# EAGLE design stm32_bob_v2 (EAGLE 7.3.0)
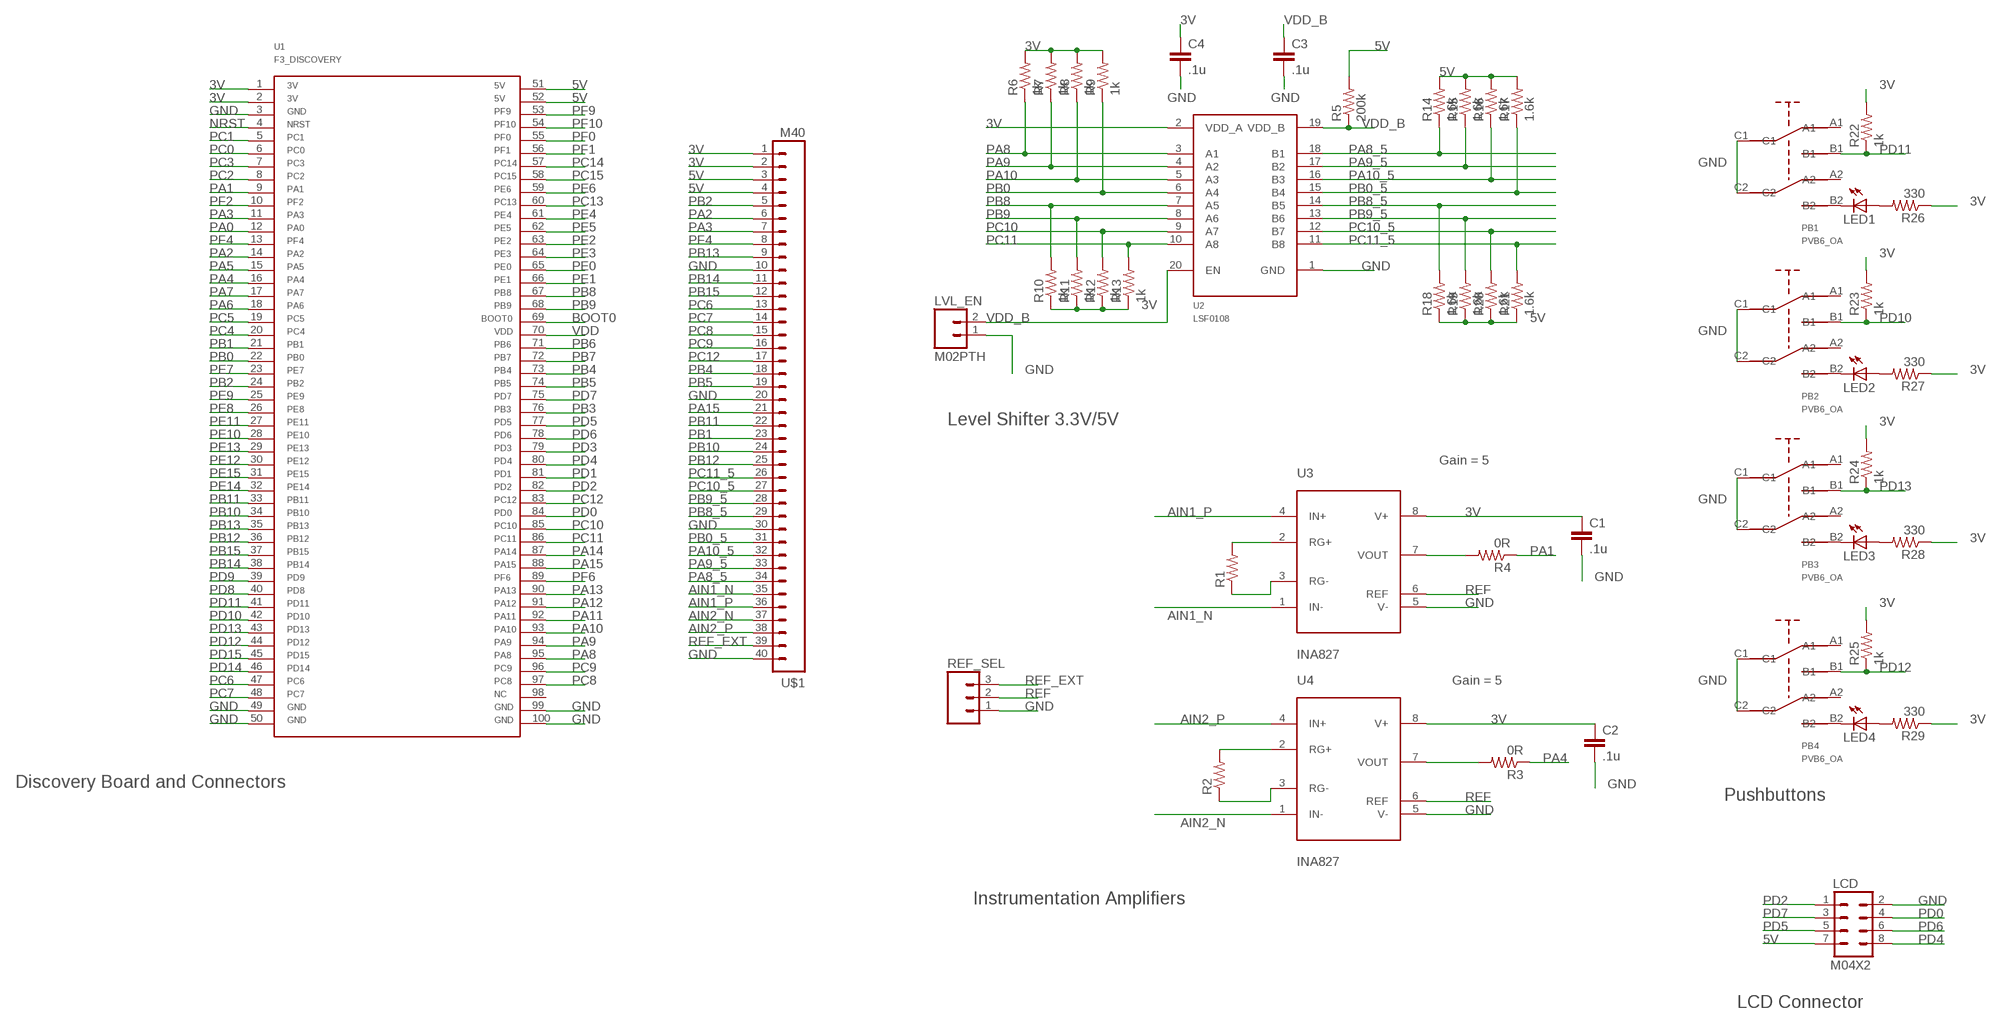
[diagram p0: schematic, sheet 1]

## Parts
C1  .1u  C-EUC0805  [C0805]
C2  .1u  C-EUC0805  [C0805]
C3  .1u  C-EUC0805  [C0805]
C4  .1u  C-EUC0805  [C0805]
LCD  M04X2  [2X4]
LED1  LED1206  [LED-1206]
LED2  LED1206  [LED-1206]
LED3  LED1206  [LED-1206]
LED4  LED1206  [LED-1206]
LVL_EN  M02PTH  [1X02]
PB1  PVB6_OA  [PVB6_OA]
PB2  PVB6_OA  [PVB6_OA]
PB3  PVB6_OA  [PVB6_OA]
PB4  PVB6_OA  [PVB6_OA]
R1  R-US_R1206  [R1206]
R2  R-US_R1206  [R1206]
R3  0R  R-US_R1206  [R1206]
R4  0R  R-US_R1206  [R1206]
R5  200k  R-US_R0805  [R0805]
R6  1k  R-US_R0805  [R0805]
R7  1k  R-US_R0805  [R0805]
R8  1k  R-US_R0805  [R0805]
R9  1k  R-US_R0805  [R0805]
R10  1k  R-US_R0805  [R0805]
R11  1k  R-US_R0805  [R0805]
R12  1k  R-US_R0805  [R0805]
R13  1k  R-US_R0805  [R0805]
R14  1.6k  R-US_R0805  [R0805]
R15  1.6k  R-US_R0805  [R0805]
R16  1.6k  R-US_R0805  [R0805]
R17  1.6k  R-US_R0805  [R0805]
R18  1.6k  R-US_R0805  [R0805]
R19  1.6k  R-US_R0805  [R0805]
R20  1.6k  R-US_R0805  [R0805]
R21  1.6k  R-US_R0805  [R0805]
R22  1k  R-US_R0805  [R0805]
R23  1k  R-US_R0805  [R0805]
R24  1k  R-US_R0805  [R0805]
R25  1k  R-US_R0805  [R0805]
R26  330  R-US_R0805  [R0805]
R27  330  R-US_R0805  [R0805]
R28  330  R-US_R0805  [R0805]
R29  330  R-US_R0805  [R0805]
REF_SEL  M03PTH  [1X03]
U1  F3_DISCOVERY  [F3_DISCOVERY]
U2  LSF0108  [LSF0108]
U3  INA827  [MSOP8]
U4  INA827  [MSOP8]
U$1  M40  [1X40]

## Nets
3V: C1.1 C2.1 C4.1 R6.2 R7.2 R8.2 R9.2 R10.1 R11.1 R12.1 R13.1 R22.2 R23.2 R24.2 R25.2 R26.1 R27.1 R28.1 R29.1 U1.1 U1.2 U2.2(VDD_A) U3.8(V+) U4.8(V+) U$1.1 U$1.2
5V: LCD.7 R5.2 R14.2 R15.2 R16.2 R17.2 R18.1 R19.1 R20.1 R21.1 U1.51 U1.52 U$1.3 U$1.4
AIN1_N: U3.1(IN-) U$1.35
AIN1_P: U3.4(IN+) U$1.36
AIN2_N: U4.1(IN-) U$1.37
AIN2_P: U4.4(IN+) U$1.38
BOOT0: U1.69
GND: C1.2 C2.2 C3.2 C4.2 LCD.2 LVL_EN.1 PB1.C1 PB1.C2 PB2.C1 PB2.C2 PB3.C1 PB3.C2 PB4.C1 PB4.C2 REF_SEL.1 U1.3 U1.49 U1.50 U1.99 U1.100 U2.1(GND) U3.5(V-) U4.5(V-) U$1.10 U$1.20 U$1.30 U$1.40
N$13: R1.2 U3.2(RG+)
N$14: R1.1 U3.3(RG-)
N$15: R2.2 U4.2(RG+)
N$16: R2.1 U4.3(RG-)
N$17: R4.2 U3.7(VOUT)
N$18: R3.2 U4.7(VOUT)
N$19: LED1.C PB1.B2
N$20: LED2.C PB2.B2
N$21: LED3.C PB3.B2
N$22: LED4.C PB4.B2
N$23: LED1.A R26.2
N$24: LED2.A R27.2
N$25: LED3.A R28.2
N$26: LED4.A R29.2
NRST: U1.4
PA0: U1.12
PA1: R4.1 U1.9
PA2: U1.14 U$1.6
PA3: U1.11 U$1.7
PA4: R3.1 U1.16
PA5: U1.15
PA6: U1.18
PA7: U1.17
PA8: R6.1 U1.95 U2.3(A1)
PA8_5: R14.1 U2.18(B1) U$1.34
PA9: R7.1 U1.94 U2.4(A2)
PA9_5: R15.1 U2.17(B2) U$1.33
PA10: R8.1 U1.93 U2.5(A3)
PA10_5: R16.1 U2.16(B3) U$1.32
PA11: U1.92
PA12: U1.91
PA13: U1.90
PA14: U1.87
PA15: U1.88 U$1.21
PB0: R9.1 U1.22 U2.6(A4)
PB0_5: R17.1 U2.15(B4) U$1.31
PB1: U1.21 U$1.23
PB2: U1.24 U$1.5
PB3: U1.76
PB4: U1.73 U$1.18
PB5: U1.74 U$1.19
PB6: U1.71
PB7: U1.72
PB8: R10.2 U1.67 U2.7(A5)
PB8_5: R18.2 U2.14(B5) U$1.29
PB9: R11.2 U1.68 U2.8(A6)
PB9_5: R19.2 U2.13(B6) U$1.28
PB10: U1.34 U$1.24
PB11: U1.33 U$1.22
PB12: U1.36 U$1.25
PB13: U1.35 U$1.9
PB14: U1.38 U$1.11
PB15: U1.37 U$1.12
PC0: U1.6
PC1: U1.5
PC2: U1.8
PC3: U1.7
PC4: U1.20
PC5: U1.19
PC6: U1.47 U$1.13
PC7: U1.48 U$1.14
PC8: U1.97 U$1.15
PC9: U1.96 U$1.16
PC10: R12.2 U1.85 U2.9(A7)
PC10_5: R20.2 U2.12(B7) U$1.27
PC11: R13.2 U1.86 U2.10(A8)
PC11_5: R21.2 U2.11(B8) U$1.26
PC12: U1.83 U$1.17
PC13: U1.60
PC14: U1.57
PC15: U1.58
PD0: LCD.4 U1.84
PD1: U1.81
PD2: LCD.1 U1.82
PD3: U1.79
PD4: LCD.8 U1.80
PD5: LCD.5 U1.77
PD6: LCD.6 U1.78
PD7: LCD.3 U1.75
PD8: U1.40
PD9: U1.39
PD10: PB2.B1 R23.1 U1.42
PD11: PB1.B1 R22.1 U1.41
PD12: PB4.B1 R25.1 U1.44
PD13: PB3.B1 R24.1 U1.43
PD14: U1.46
PD15: U1.45
PE0: U1.65
PE1: U1.66
PE2: U1.63
PE3: U1.64
PE4: U1.61
PE5: U1.62
PE6: U1.59
PE7: U1.23
PE8: U1.26
PE9: U1.25
PE10: U1.28
PE11: U1.27
PE12: U1.30
PE13: U1.29
PE14: U1.32
PE15: U1.31
PF0: U1.55
PF1: U1.56
PF2: U1.10
PF4: U1.13 U$1.8
PF6: U1.89
PF9: U1.53
PF10: U1.54
REF: REF_SEL.2 U3.6(REF) U4.6(REF)
REF_EXT: REF_SEL.3 U$1.39
VDD: U1.70
VDD_B: C3.1 LVL_EN.2 R5.1 U2.19(VDD_B) U2.20(EN)
Unconnected: PB1.A1 PB1.A2 PB2.A1 PB2.A2 PB3.A1 PB3.A2 PB4.A1 PB4.A2 U1.98

## Notes on the sheet
- Level Shifter 3.3V/5V
- Gain = 5
- Gain = 5
- Discovery Board and Connectors
- Pushbuttons
- Instrumentation Amplifiers
- LCD Connector

## Library data of the parts
C1-C4 = rcl:C-EU: CAPACITOR, European symbol
LCD = SparkFun-Connectors:M04X2: .1" header, two rows of four.
LED1-LED4 = SparkFun-LED:LED: LEDs Standard schematic elements and footprints for 5mm, 3mm, 1206, and 0603 sized LEDs. 5mm - Spark Fun Electronics SKU : COM-00529 (and others)
LVL_EN = SparkFun-Connectors:M02: Standard 2-pin 0.1" header. Use with - straight break away headers ( PRT-00116) - right angle break away headers (PRT-00553) - swiss pins (PRT-00743) - machine pins (PRT-00117) - female headers (PRT-00115) Molex polarized connector foot print use with: PRT-08233 with associated crimp pins and housings. 2.54_SCREWTERM for use with PRT-10571. 3.5mm Screw Terminal footprints for PRT-08084 5mm Screw Terminal footprints for use with PRT-08433
PB1-PB4 = green-electronics:PVB6_OA
R1-R29 = rcl:R-US_: RESISTOR, American symbol
REF_SEL = SparkFun-Connectors:M03: Header 3 Standard 3-pin 0.1" header. Use with straight break away headers (SKU : PRT-00116), right angle break away headers (PRT-00553), swiss pins (PRT-00743), machine pins (PRT-00117), and female headers (PRT-00115). Molex polarized connector foot print use with SKU : PRT-08232 with associated crimp pins and housings.
U1 = green-electronics:F3_DISCOVERY
U2 = green-electronics:LSF0108
U3 U4 = littlebox:INA827
U$1 = SparkFun-Connectors:M40: 1x40 .1" header

## Board
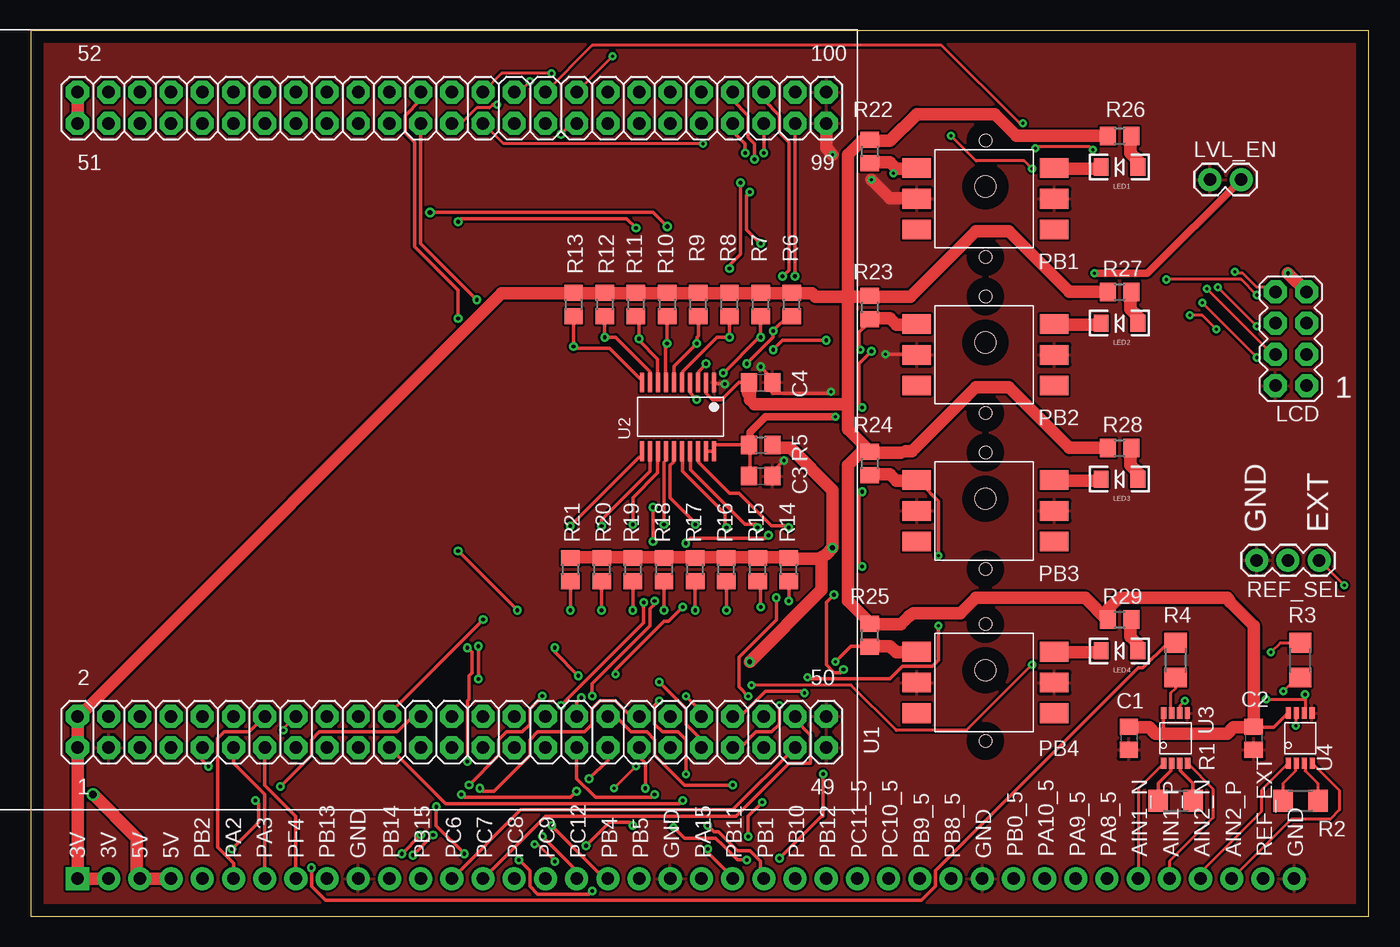
[diagram p1: board, top side]
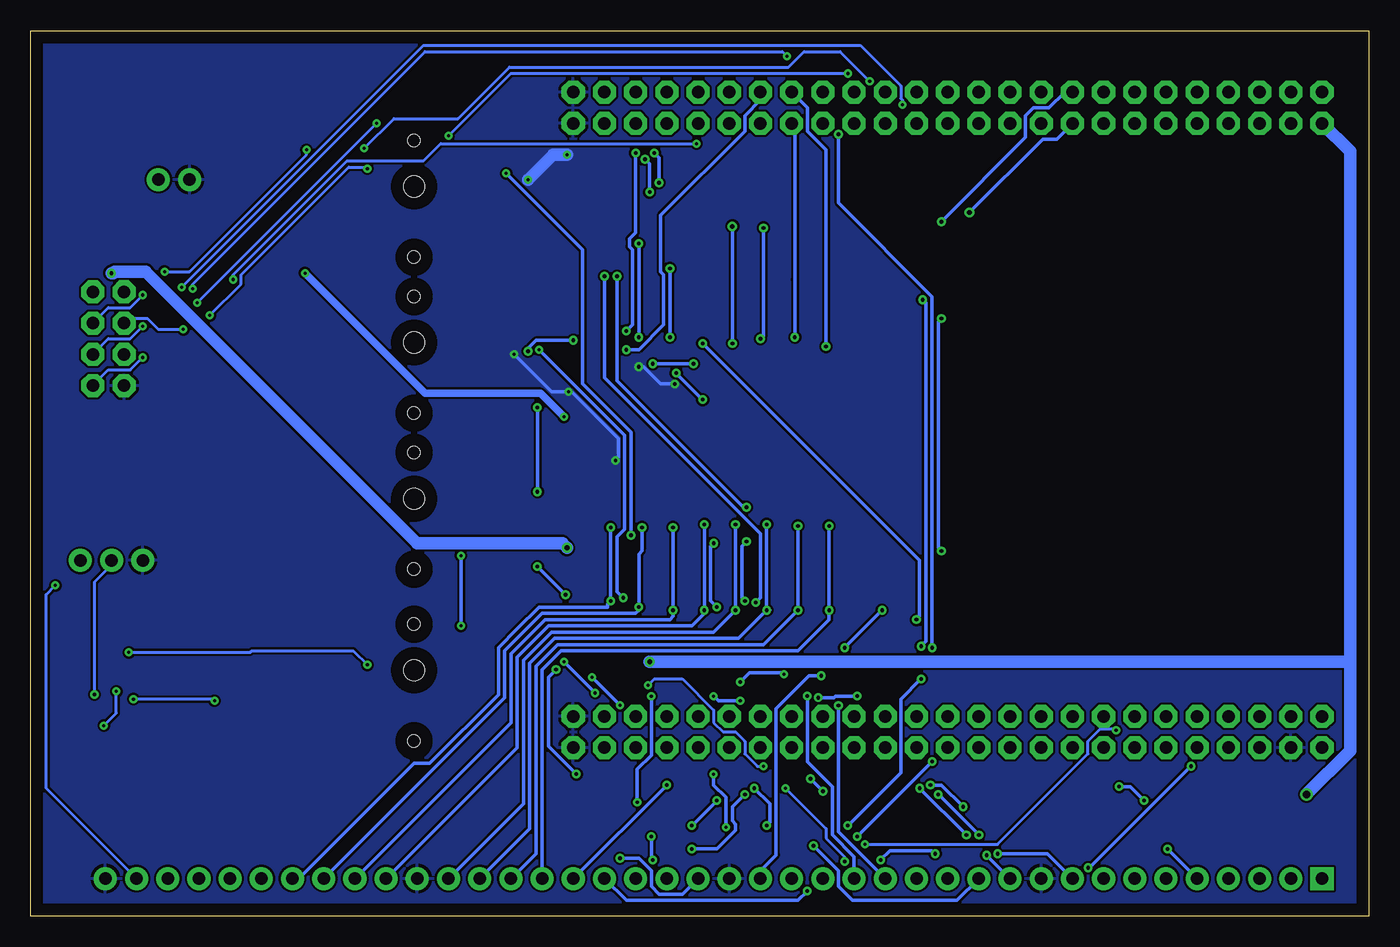
[diagram p2: board, bottom side, seen from below]

Size 108.95 x 72.06 mm. Coordinates in mm from the lower left corner, seen from the top.
Outline: 0,0 108.95,0 108.95,72.06 0,72.06 0,0
Copper layers (1*16): Top 0.035mm / dielectric 1.5mm / Bottom 0.035mm
Design rules "default *": minimum track width 10mil, minimum drill 10mil, track to track 7mil, track to pad 7mil, pad to pad 7mil, via to via 7mil, smd to smd 0mil, copper to edge 40mil, drill to drill 8mil, minimum pad ring 10mil, minimum via ring 8mil, stop-mask expansion 4mil, vias tented up to drill 25mil, thermal gap 10mil

### Footprints (pad centres in the part's own frame; a part is rotated, then mirrored left to right if it is on the bottom)
C0805 = smd 1.3 x 1.5: 1 -0.95,0; 2 0.95,0
2X4 = drill 1.016 pad 1.88 octagon: 1 -3.81,-1.27; 2 -3.81,1.27; 3 -1.27,-1.27; 4 -1.27,1.27; 5 1.27,-1.27; 6 1.27,1.27; 7 3.81,-1.27; 8 3.81,1.27
LED-1206 = smd 1.2 x 1.4: A -1.5,0; C 1.5,0
1X02 = drill 1.016 pad 1.88: 1 0,0; 2 2.54,0
PVB6_OA = smd 2.3 x 1.6: A1 0,0; A2 11.2,0; B1 0,5; B2 11.2,5; C1 0,2.5; C2 11.2,2.5 | hole 1: 5.6,7.25; 5.6,-2.25 | hole 1.7: 5.6,3.5
R1206 = smd 1.6 x 1.803: 1 -1.422,0; 2 1.422,0
R0805 = smd 1.3 x 1.5: 1 -0.95,0; 2 0.95,0
1X03 = drill 1.016 pad 1.88: 1 0,0; 2 2.54,0; 3 5.08,0
F3_DISCOVERY = drill 1.016 pad 1.88 octagon: 1 0,0; 2 0,2.54; 3 2.54,0; 4 2.54,2.54; 5 5.08,0; 6 5.08,2.54; 7 7.62,0; 8 7.62,2.54; 9 10.16,0; 10 10.16,2.54; 11 12.7,0; 12 12.7,2.54; 13 15.24,0; 14 15.24,2.54; 15 17.78,0; 16 17.78,2.54; 17 20.32,0; 18 20.32,2.54; 19 22.86,0; 20 22.86,2.54; 21 25.4,0; 22 25.4,2.54; 23 27.94,0; 24 27.94,2.54; 25 30.48,0; 26 30.48,2.54; 27 33.02,0; 28 33.02,2.54; 29 35.56,0; 30 35.56,2.54; 31 38.1,0; 32 38.1,2.54; 33 40.64,0; 34 40.64,2.54; 35 43.18,0; 36 43.18,2.54; 37 45.72,0; 38 45.72,2.54; 39 48.26,0; 40 48.26,2.54; 41 50.8,0; 42 50.8,2.54; 43 53.34,0; 44 53.34,2.54; 45 55.88,0; 46 55.88,2.54; 47 58.42,0; 48 58.42,2.54; 49 60.96,0; 50 60.96,2.54; 51 0,50.8; 52 0,53.34; 53 2.54,50.8; 54 2.54,53.34; 55 5.08,50.8; 56 5.08,53.34; 57 7.62,50.8; 58 7.62,53.34; 59 10.16,50.8; 60 10.16,53.34; 61 12.7,50.8; 62 12.7,53.34; 63 15.24,50.8; 64 15.24,53.34; 65 17.78,50.8; 66 17.78,53.34; 67 20.32,50.8; 68 20.32,53.34; 69 22.86,50.8; 70 22.86,53.34; 71 25.4,50.8; 72 25.4,53.34; 73 27.94,50.8; 74 27.94,53.34; 75 30.48,50.8; 76 30.48,53.34; 77 33.02,50.8; 78 33.02,53.34; 79 35.56,50.8; 80 35.56,53.34; 81 38.1,50.8; 82 38.1,53.34; 83 40.64,50.8; 84 40.64,53.34; 85 43.18,50.8; 86 43.18,53.34; 87 45.72,50.8; 88 45.72,53.34; 89 48.26,50.8; 90 48.26,53.34; 91 50.8,50.8; 92 50.8,53.34; 93 53.34,50.8; 94 53.34,53.34; 95 55.88,50.8; 96 55.88,53.34; 97 58.42,50.8; 98 58.42,53.34; 99 60.96,50.8; 100 60.96,53.34
LSF0108 = smd 0.3 x 1.6: 1 0,0; 2 0.65,0; 3 1.3,0; 4 1.95,0; 5 2.6,0; 6 3.25,0; 7 3.9,0; 8 4.55,0; 9 5.2,0; 10 5.85,0; 11 5.85,5.6; 12 5.2,5.6; 13 4.55,5.6; 14 3.9,5.6; 15 3.25,5.6; 16 2.6,5.6; 17 1.95,5.6; 18 1.3,5.6; 19 0.65,5.6; 20 0,5.6
MSOP8 = smd 0.9 x 0.42: 1 -2.05,0.975; 2 -2.05,0.325; 3 -2.05,-0.325; 4 -2.05,-0.975; 5 2.05,-0.945; 6 2.05,-0.325; 7 2.05,0.325; 8 2.05,0.975
1X40 = drill 1.016 pad 1.88 square: 1 -49.53,0 | drill 1.016 pad 1.88: 2 -46.99,0; 3 -44.45,0; 4 -41.91,0; 5 -39.37,0; 6 -36.83,0; 7 -34.29,0; 8 -31.75,0; 9 -29.21,0; 10 -26.67,0; 11 -24.13,0; 12 -21.59,0; 13 -19.05,0; 14 -16.51,0; 15 -13.97,0; 16 -11.43,0; 17 -8.89,0; 18 -6.35,0; 19 -3.81,0; 20 -1.27,0; 21 1.27,0; 22 3.81,0; 23 6.35,0; 24 8.89,0; 25 11.43,0; 26 13.97,0; 27 16.51,0; 28 19.05,0; 29 21.59,0; 30 24.13,0; 31 26.67,0; 32 29.21,0; 33 31.75,0; 34 34.29,0; 35 36.83,0; 36 39.37,0; 37 41.91,0; 38 44.45,0; 39 46.99,0; 40 49.53,0

### Placement (x,y rotation side)
C1  89.41,14.48 270 top
C2  99.57,14.48 270 top
C3  59.44,35.81 0 top
C4  59.44,43.43 0 top
LCD  102.62,46.99 90 top
LED1  88.65,60.96 180 top
LED2  88.65,48.26 180 top
LED3  88.65,35.56 180 top
LED4  88.65,21.59 180 top
LVL_EN  96.01,59.94 0 top
PB1  72.14,55.88 0 top
PB2  72.14,43.18 0 top
PB3  72.14,30.48 0 top
PB4  72.14,16.51 0 top
R1  93.22,9.4 180 top
R2  103.38,9.4 180 top
R3  103.38,20.83 270 top
R4  93.22,20.83 270 top
R5  59.44,38.35 0 top
R6  61.98,49.78 90 top
R7  59.44,49.78 90 top
R8  56.9,49.78 90 top
R9  54.36,49.78 90 top
R10  51.82,49.78 270 top
R11  49.28,49.78 270 top
R12  46.74,49.78 270 top
R13  44.2,49.78 270 top
R14  61.72,28.19 90 top
R15  59.18,28.19 90 top
R16  56.64,28.19 90 top
R17  54.1,28.19 90 top
R18  51.56,28.19 270 top
R19  49.02,28.19 270 top
R20  46.48,28.19 270 top
R21  43.94,28.19 270 top
R22  68.33,62.23 90 top
R23  68.33,49.53 90 top
R24  68.33,36.83 90 top
R25  68.33,22.86 90 top
R26  88.65,63.5 0 top
R27  88.65,50.8 0 top
R28  88.65,38.1 0 top
R29  88.65,24.13 0 top
REF_SEL  99.82,28.96 0 top
U1  3.81,13.72 0 top
U2  55.63,43.43 180 top
U3  93.22,14.48 90 top
U4  103.38,14.48 90 top
U$1  53.34,3.05 0 top

### Tracks (layer width: path | path; a pad name or v marks a point on that pad's centre or on a via)
3V
  Top 0.305: C4.1 58.42,43.43 57.66,43.43 56.26,42.04 55.5,42.04 54.99,42.55 U2.2 | U3.8 92.2,16.51 92.2,15.24 92.2,14.86 | U4.8 102.36,16.51 101.22,15.37 100.08,15.37 C2.1
  Top 1.016: U$1.2 4.06,3.05 U$1.1 3.81,4.83 3.81,5.08 3.81,13.46 U1.1 U1.2 4.19,16.51 38.35,50.67 43.81,50.67 R13.1 44.2,50.67 46.74,50.67 R12.1 47.12,50.67 49.28,50.67 R11.1 49.66,50.67 51.82,50.67 R10.1 52.2,50.67 54.36,50.67 R9.2 54.74,50.67 56.9,50.67 R8.2 57.28,50.67 59.44,50.67 R7.2 59.82,50.67 61.98,50.67 R6.2 62.36,50.67 63.63,50.67 63.88,50.42 66.55,50.42 | 66.55,50.42 68.33,50.42 R23.2 68.71,50.42 68.83,50.42 69.22,50.42 71.63,50.42 76.96,55.75 79.63,55.75 84.58,50.8 87.63,50.8 R27.1 | 66.55,50.42 66.55,50.8 66.55,61.98 67.69,63.12 68.33,63.12 R22.2 68.71,63.12 69.98,63.12 72.14,65.28 78.49,65.28 80.26,63.5 87.63,63.5 R26.1 | 66.55,41.66 66.55,39.62 68.33,37.85 R24.2 | 66.55,41.66 66.55,50.04 66.55,50.42 | 58.55,42.55 58.42,42.55 | 58.55,42.55 58.55,42.04 58.93,41.66 66.17,41.66 66.55,41.66 | C4.1 58.55,43.31 58.55,42.93 58.55,42.55 | R24.2 67.69,37.85 66.55,36.7 66.55,25.65 68.33,23.88 R25.2 68.71,23.75 70.87,23.75 71.5,24.38 71.88,24.64 75.69,24.64 76.96,25.91 85.85,25.91 87.63,24.13 R29.1 87.76,24.64 87.76,25.02 88.65,25.91 97.41,25.91 97.66,25.53 99.57,23.62 99.57,15.49 C2.1 99.19,15.37 97.92,15.37 97.41,14.86 92.2,14.86 91.57,14.86 91.06,15.37 89.41,15.37 C1.1 | R28.1 87.63,38.1 84.58,38.1 79.63,43.05 76.96,43.05 71.75,37.85 71.25,37.85 70.87,37.72 68.96,37.72 68.83,37.85 R24.2
5V  (via drill 0.3, 0.38, 0.6)
  Top 1.016: U$1.4 U$1.3 8.64,3.3 8.64,6.35 v5.08,9.91 | U1.52 U1.51 | R21.1 43.94,29.21 46.48,29.21 R20.1 46.74,29.21 49.02,29.21 R19.1 49.28,29.21 51.56,29.21 R18.1 51.82,29.21 54.1,29.21 R17.2 54.36,29.21 56.64,29.21 R16.2 56.9,29.21 59.18,29.21 R15.2 59.44,29.21 61.72,29.21 R14.2 62.1,29.08 64.01,29.08 64.39,29.08 | 64.39,29.08 64.39,26.54 v58.55,20.7 | 64.39,29.08 64.39,29.21 64.77,29.46 v65.28,29.97 65.28,30.35 65.28,34.67 61.85,38.1 60.45,38.1 60.33,38.23 60.33,38.35 R5.2 | v102.36,52.32 LCD.7
  Bottom 1.016: v5.08,9.91 1.52,13.46 1.52,20.7 | 1.52,20.7 1.52,62.23 U1.51 | v58.55,20.7 1.91,20.7 1.52,20.7 | v102.36,52.32 102.23,52.32 102.11,52.45 99.57,52.45 77.47,30.35 65.66,30.35 v65.28,29.97
AIN1_N
  Top 0.254: U3.1 90.17,10.36 90.17,7.75 U$1.35
AIN1_P
  Top 0.254: U3.4 96.27,10.36 96.27,8 92.71,4.45 U$1.36
AIN2_N
  Top 0.254: U4.1 100.2,10.23 100.2,8.51 95.25,3.56 U$1.37
AIN2_P
  Top 0.254: U4.4 106.55,10.23 106.55,8.64 105.79,7.87 102.62,7.87 U$1.38
GND  (via drill 0.25, 0.3)
  Top 0.305: v69.6,45.72 72.14,45.72 PB2.C1 | v65.15,42.67 65.02,42.55 60.45,42.55 60.33,42.67 60.33,43.43 C4.2 60.33,43.56 60.33,43.81 v59.44,44.7 | v61.34,37.08 60.33,36.07 60.33,35.81 C3.2 | v56.52,43.31 55.63,43.31 U2.1
  Top 1.016: U1.99 64.77,62.48 v65.28,61.98 | v68.45,59.94 69.98,58.42 72.14,58.42 PB1.C1
  Bottom 0.305: v69.6,45.72 66.55,42.67 v65.15,42.67 65.02,42.67 64.9,42.67 61.09,38.86 61.09,37.34 v61.34,37.08 | v59.44,44.7 59.05,44.7 57.66,43.31 v56.52,43.31
  Bottom 1.016: v65.28,61.98 66.42,61.98 v68.45,59.94
  pour Top: 109.22,71.88 109.22,-0.25 0,-0.25 0.25,71.88
  pour Bottom: 0.25,72.39 109.47,72.39 109.47,0.25 0.25,0.25
N$13
  Top 0.305: U3.2 92.84,12.32 92.84,11.81 91.82,10.79 91.82,9.4 R1.2
N$14
  Top 0.305: U3.3 93.6,12.32 93.6,11.81 94.61,10.79 94.61,9.4 R1.1
N$15
  Top 0.254: U4.2 103,12.32 103,11.81 101.98,10.79 101.98,9.4 R2.2
N$16
  Top 0.254: R2.1 104.78,9.4 104.78,10.79 103.76,11.81 103.76,12.32 U4.3
N$17
  Top 0.254: R4.2 93.22,19.3 93.22,18.54 92.84,18.16 92.84,16.64 U3.7
N$18  (via drill 0.25)
  Top 0.254: v101.98,18.29 103.12,19.43 103.38,19.43 R3.2 | v103,15.49 103,16.51 U4.7
  Bottom 0.254: v101.98,18.29 101.98,16.51 v103,15.49
N$19
  Top 1.016: PB1.B2 83.44,60.83 87.12,60.83 87.25,60.96 LED1.C
N$20
  Top 1.016: PB2.B2 83.44,48.13 87.12,48.13 87.25,48.26 LED2.C
N$21
  Top 1.016: PB3.B2 83.44,35.43 87.12,35.43 87.25,35.56 LED3.C
N$22
  Top 1.016: PB4.B2 83.44,21.46 87.12,21.46 87.25,21.59 LED4.C
N$23
  Top 1.016: LED1.A 90.17,60.96 90.17,61.47 89.53,62.1 89.53,63.5 R26.2
N$24
  Top 1.016: LED2.A 90.17,48.26 90.17,48.77 89.53,49.4 89.53,50.8 R27.2
N$25
  Top 1.016: LED3.A 90.17,35.56 90.17,36.07 89.53,36.7 89.53,38.1 R28.2
N$26
  Top 1.016: LED4.A 90.17,21.59 90.17,22.1 89.53,22.73 89.53,24.13 R29.2
PA1  (via drill 0.3)
  Top 0.305: U1.9 13.97,12.7 v14.48,12.19 | v22.86,3.94 22.86,2.41 24,1.27 72.52,1.27 73.66,2.41 73.66,3.68 90.17,20.19 90.55,20.19 92.58,22.23 93.22,22.23 R4.1
  Bottom 0.305: v14.48,12.19 22.73,3.94 v22.86,3.94
PA2
  Top 0.305: U$1.6 16.51,4.32 15.24,5.59 15.24,14.48 15.75,14.99 17.78,14.99 U1.14
PA3
  Top 0.305: U$1.7 19.05,9.91 16.51,12.45 U1.11
PA4  (via drill 0.25)
  Top 0.254: v81.53,20.45 76.2,15.11 70.48,15.11 66.8,18.8 60.2,18.8 v58.67,18.8 | v100.97,21.46 101.73,22.23 103.38,22.23 R3.1 | U1.16 20.57,15.24 v20.57,15.11 | v41.02,5.84 41.27,5.84 v42.67,4.45 | v49.28,12.19 v47.5,10.41
  Bottom 0.254: v81.53,20.45 82.68,21.59 90.93,21.59 91.06,21.46 v100.97,21.46 | v20.57,15.11 20.7,15.24 21.84,15.24 22.86,14.22 22.86,13.21 30.23,5.84 v41.02,5.84 | v42.67,4.45 42.67,4.83 44.2,6.35 44.2,7.11 v47.5,10.41 | v49.28,12.19 49.78,12.19 50.8,13.21 50.8,14.22 51.56,14.99 52.58,14.99 53.34,15.75 53.34,16.76 55.88,19.3 58.17,19.3 v58.67,18.8
PA8  (via drill 0.3)
  Top 0.305: U1.95 v59.69,62.1 | R6.1 61.98,48.9 61.72,48.9 v60.45,47.62 60.45,47.5 60.45,47.12 v58.29,44.96 | v54.99,44.96 54.36,44.32 54.36,43.43 U2.3
  Bottom 0.305: v60.45,47.62 59.94,48.13 59.94,54.23 60.2,54.48 60.2,55.12 59.69,55.63 v59.69,62.1 | v54.99,44.96 v58.29,44.96
PA8_5  (via drill 0.3)
  Top 0.305: 61.72,27.43 61.98,27.18 61.72,26.92 v61.72,25.65 R14.1 | v61.72,31.62 61.72,31.75 60.33,31.75 57.66,34.42 56.9,34.42 54.36,36.96 54.36,37.72 54.33,37.72 U2.18
  Bottom 0.305: U$1.34 87.12,3.05 77.72,12.45 76.45,12.45 70.87,18.03 70.87,21.84 69.34,23.37 67.56,25.15 61.98,25.15 61.98,25.4 v61.72,25.65 61.72,25.78 v61.72,31.62
PA9  (via drill 0.3)
  Top 0.305: v59.44,54.74 58.29,55.88 58.29,58.67 v58.55,58.93 | v58.93,61.59 58.93,62.87 58.42,63.37 58.42,65.15 57.15,66.42 U1.94 | R7.1 v59.44,47.12 59.31,47.12 v56.39,44.2 | v54.23,42.04 53.72,42.55 53.72,43.43 U2.4
  Bottom 0.305: v58.55,58.93 58.55,61.21 v58.93,61.59 | v59.44,54.74 v59.44,47.12 | v54.23,42.04 v56.39,44.2
PA9_5  (via drill 0.3)
  Top 0.305: v59.44,25.15 59.44,27.18 59.24,27.37 | 59.18,27.43 59.24,27.37 | v59.18,31.62 59.05,31.75 59.05,31.88 58.17,31.88 53.72,36.32 53.72,37.72 53.72,37.83 U2.17 | R15.1 59.24,27.24 59.24,27.37
  Bottom 0.305: v59.44,25.15 59.44,24.89 | 59.44,24.89 59.69,24.64 67.31,24.64 69.34,22.61 70.36,21.59 70.36,17.78 U$1.33 | 59.44,24.89 v59.44,25.15 | v59.18,31.62 59.18,29.84 59.18,29.72 59.44,29.46 59.44,25.27 v59.44,25.15
PA10  (via drill 0.3)
  Top 0.305: v57.78,59.69 57.78,53.98 57.78,53.85 56.9,52.96 v56.9,52.7 | v58.17,62.1 58.17,62.87 57.15,63.88 U1.93 | R8.1 v56.9,47.12 56.77,47.12 55.88,47.12 53.09,44.32 53.09,43.43 U2.5
  Bottom 0.305: v57.78,59.69 57.78,61.72 v58.17,62.1 | v56.9,52.7 v56.9,47.12
PA10_5  (via drill 0.3)
  Top 0.305: v56.64,24.89 56.64,27.18 R16.1 | v56.64,31.62 56.52,31.75 56.52,31.88 56.52,32.77 53.09,36.2 53.09,37.72 53.03,37.72 U2.16
  Bottom 0.305: U$1.32 69.85,15.75 69.85,21.34 69.09,22.1 67.06,24.13 56.9,24.13 56.64,24.38 v56.64,24.89 56.64,25.02 v56.64,31.62
PA15  (via drill 0.3)
  Top 0.305: v64.52,11.56 64.52,8.13 64.39,8.13 v60.96,4.7 | v66.17,20.07 65.91,19.81 65.41,19.81 64.77,20.45 64.77,25.53 v65.41,26.16 | v67.69,28.45 67.44,28.7 67.44,34.29 v67.69,34.54 | v67.69,41.4 67.44,41.66 67.44,44.96 v68.45,45.97 | v64.77,46.86 61.21,46.86 v60.45,46.1
  Bottom 0.305: v64.52,11.56 66.8,13.84 66.8,19.43 v66.17,20.07 | v67.69,28.45 v65.41,26.16 | v67.69,41.4 v67.69,34.54 | v68.45,45.97 68.45,46.23 67.82,46.86 v64.77,46.86 | v60.45,46.1 59.44,46.1 57.4,48.13 57.4,52.2 57.66,52.45 57.66,57.02 50.8,63.88 50.8,65.15 49.53,66.42 U1.88 | v60.96,4.7 59.44,4.7 58.42,3.68 58.42,2.41 57.78,1.78 55.88,1.78 U$1.21
PB0  (via drill 0.3)
  Top 0.305: v36.83,24.13 29.21,16.51 U1.22 | R9.1 54.36,48.77 54.36,47.24 54.23,47.12 54.23,46.99 v54.23,46.61 52.45,44.83 52.38,44.76 U2.6
  Bottom 0.305: v54.23,46.61 36.58,28.96 36.58,24.38 v36.83,24.13
PB0_5  (via drill 0.3)
  Top 0.305: v54.1,24.89 54.1,27.18 R17.1 | v54.1,31.88 54.1,32 52.07,34.04 52.07,36.7 52.32,36.96 52.32,37.72 52.38,37.72 U2.15
  Bottom 0.305: v54.1,24.89 54.1,24.64 | 54.1,24.64 55.12,23.62 66.8,23.62 67.82,22.61 69.34,21.08 69.34,13.72 U$1.31 | 54.1,24.64 v54.1,24.89 | v54.1,31.88 54.1,25.02 v54.1,24.89
PB1  (via drill 0.3)
  Top 0.305: U1.21 33.78,9.14 52.83,9.14 v53.09,9.4 | 59.44,3.05 U$1.23 59.44,3.17 59.44,4.45 58.55,5.33 57.53,5.33 56.01,6.86 55.63,6.86 v55.12,7.37
  Bottom 0.305: v55.12,7.37 v53.09,9.4
PB2  (via drill 0.3)
  Top 0.305: U1.24 31.11,16.26 29.84,14.99 23.5,14.99 22.86,14.35 22.86,13.08 v20.32,10.54 | v18.29,9.4 18.54,9.14 18.54,7.62 v16.38,5.46
  Bottom 0.305: v20.32,10.54 19.43,10.54 v18.29,9.4 | U$1.5 v16.38,5.46
PB4  (via drill 0.3)
  Top 0.305: U1.73 31.75,54.74 v36.32,50.16 | v36.45,19.3 v36.45,21.97 | v42.42,7.37 46.74,3.05 U$1.18
  Bottom 0.305: v36.32,50.16 36.07,49.91 36.07,22.35 v36.45,21.97 | v36.45,19.3 38.1,17.65 38.1,11.68 v42.42,7.37
PB5  (via drill 0.3)
  Top 0.305: U1.74 31.75,66.42 30.48,65.15 30.48,63.75 31.24,62.99 31.24,54.48 34.8,50.93 v34.8,48.64 | v39.62,24.89 v34.8,29.72 | v42.67,21.84 42.67,21.46 v44.58,19.56
  Bottom 0.305: v34.8,48.64 35.05,48.39 35.05,29.97 v34.8,29.72 | v42.67,21.84 v39.62,24.89 | v44.58,19.56 45.59,19.56 48.26,16.89 48.26,4.95 49.53,3.68 U$1.19
PB8  (via drill 0.3, 0.38)
  Top 0.305: v32.51,57.28 41.91,57.28 50.67,57.28 v51.82,56.13 | R10.2 v51.82,46.61 51.82,46.48 51.69,46.35 51.69,43.43 U2.7
  Bottom 0.305: v32.51,57.28 26.54,63.25 25.4,63.25 U1.67 | v51.82,56.13 v51.82,46.61
PB8_5  (via drill 0.3)
  Top 0.305: v51.56,24.89 51.56,27.18 R18.2 | v51.56,31.88 51.56,31.75 51.56,36.96 51.69,37.08 51.69,37.72 51.73,37.72 U2.14
  Bottom 0.305: v51.56,24.89 51.82,24.64 | 51.82,24.64 53.34,23.11 66.55,23.11 67.82,21.84 68.83,20.83 68.83,9.14 U$1.29 | 51.82,24.64 v51.56,24.89 | v51.56,31.88 51.56,25.02 v51.56,24.89
PB9  (via drill 0.3)
  Top 0.305: v49.28,56.01 48.51,56.77 35.05,56.77 v34.8,56.52 | R11.2 49.53,48.58 v49.53,46.99 49.53,46.86 51.05,45.34 51.05,43.43 U2.8
  Bottom 0.305: v34.8,56.52 27.94,63.37 27.94,65.15 27.3,65.79 26.04,65.79 24.77,67.06 U1.68 | v49.28,56.01 49.28,47.24 v49.53,46.99
PB9_5  (via drill 0.3)
  Top 0.305: v49.02,24.89 49.02,27.18 R19.2 | v49.02,31.88 49.02,32 49.02,32.13 49.02,32.26 49.02,34.04 51.05,36.07 51.05,37.72 51.08,37.72 U2.13
  Bottom 0.305: v49.02,24.89 48.77,24.89 | v49.02,24.89 51.31,22.61 66.29,22.61 67.31,21.59 68.33,20.57 68.33,7.11 U$1.28 | v49.02,31.88 49.02,25.02 v49.02,24.89
PB10  (via drill 0.3)
  Top 0.305: U1.34 44.45,17.4 v44.83,17.78 | v41.66,17.91 40.64,16.89 40.64,15.62 40.01,14.99 38.73,14.99 38.1,14.35 38.1,13.08 v35.69,10.67 | v33.02,8.89 33.02,7.37 v35.31,5.08 | v39.75,4.57 40.64,3.68 40.64,2.41 41.27,1.78 45.47,1.78 v45.72,2.03
  Bottom 0.305: v44.83,17.78 43.56,17.78 43.43,17.91 v41.66,17.91 | v35.69,10.67 34.8,10.67 v33.02,8.89 | v35.31,5.08 35.56,5.33 38.99,5.33 v39.75,4.57 | v45.72,2.03 46.48,1.27 60.45,1.27 U$1.24
PB11  (via drill 0.3)
  Top 0.305: U1.33 44.45,11.18 45.97,9.65 50.55,9.65 v50.8,9.91 | v55.12,5.46 55.12,5.21 57.15,3.17 U$1.22
  Bottom 0.305: v50.8,9.91 51.82,8.89 51.82,7.75 51.56,7.49 51.56,6.99 53.09,5.46 v55.12,5.46
PB12  (via drill 0.3)
  Top 0.305: U1.36 47.62,16.26 48.9,14.99 50.16,14.99 50.8,14.35 50.8,13.08 53.21,10.67 v57.15,10.67
  Bottom 0.305: U$1.25 v57.15,10.67
PB13  (via drill 0.3)
  Top 0.305: U1.35 46.99,12.7 v45.47,11.18 | v44.45,10.16 43.94,9.65 35.31,9.65 v35.05,9.91 | v30.23,5.08 v31.75,6.6
  Bottom 0.305: v44.45,10.16 v45.47,11.18 | v31.75,6.6 v35.05,9.91 | v30.23,5.08 26.16,5.08 U$1.9
PB14  (via drill 0.3)
  Top 0.305: U1.38 48.9,16.26 47.62,17.53 46.35,17.53 45.72,16.89 45.72,15.62 45.09,14.99 41.27,14.99 40.64,14.35 40.64,13.08 37.72,10.16 36.83,10.16 v36.58,10.41 | v31.11,4.95 v32.77,6.6
  Bottom 0.305: v32.77,6.6 v36.58,10.41 | U$1.11 v31.11,4.95
PB15  (via drill 0.3)
  Top 0.305: U1.37 49.53,12.95 50.04,12.45 v50.04,10.41 | v49.02,7.37 48.77,7.62 47.12,7.62 v45.21,5.71
  Bottom 0.305: v50.04,10.41 48.77,9.14 48.77,7.62 v49.02,7.37 | v45.21,5.71 43.18,3.68 43.18,2.41 42.04,1.27 33.53,1.27 U$1.12
PC6
  Top 0.305: U1.47 57.15,8.64 46.99,8.64 39.88,8.64 U$1.13
PC7
  Top 0.305: U1.48 62.23,16 63.5,14.73 63.5,12.45 61.72,12.45 57.4,8.13 41.91,8.13 U$1.14
PC8  (via drill 0.3)
  Top 0.305: v62.23,52.07 U1.97 | v49.91,25.53 49.91,23.88 v43.18,17.14
  Bottom 0.305: v62.23,52.07 62.23,43.81 49.53,31.11 49.53,25.91 v49.91,25.53 | v43.18,17.14 43.18,6.86 U$1.15
PC9  (via drill 0.3)
  Top 0.305: U1.96 59.69,66.42 60.96,65.15 60.96,63.75 61.72,62.99 61.72,52.58 v61.21,52.07 | v50.67,30.48 v50.67,33.27 | v50.8,25.65 50.8,25.4 50.42,25.02 50.42,23.62 45.72,18.92 v45.72,17.91
  Bottom 0.305: v61.21,52.07 61.21,43.56 50.93,33.27 v50.67,33.27 | v50.67,30.48 51.05,30.1 51.05,25.91 v50.8,25.65 | v45.72,17.91 45.72,12.57 43.69,10.54 43.69,6.6 41.91,4.83 U$1.16
PC10  (via drill 0.3)
  Top 0.305: 46.74,47.5 46.74,48.77 R12.2 | 46.74,47.5 v46.74,47.12 | U2.9 50.42,43.43 50.42,44.32 47.62,47.12 46.86,47.12 v46.74,47.12 | v46.74,47.12 46.74,47.5
  Bottom 0.305: U1.85 46.74,64.26 46.74,51.82 v46.74,47.12
PC10_5  (via drill 0.3)
  Top 0.305: R20.2 46.48,27.18 46.48,25.15 v46.48,24.89 | U2.12 50.42,37.72 50.42,36.2 46.48,32.26 46.48,31.88 v46.48,31.75
  Bottom 0.305: U$1.27 67.82,5.08 67.82,20.32 67.06,21.08 66.04,22.1 49.28,22.1 v46.48,24.89 46.48,25.02 v46.48,31.75
PC11  (via drill 0.3)
  Top 0.305: U2.10 49.78,43.56 47.12,46.23 44.2,46.23 v44.2,46.35 R13.2
  Bottom 0.305: 44.2,46.23 v44.2,46.35 44.2,62.36 45.72,63.88 45.72,65.79 U1.86
PC11_5  (via drill 0.3)
  Top 0.305: v43.94,24.89 43.94,26.92 43.69,27.18 43.94,27.43 R21.2 | v43.94,31.75 49.53,37.34 49.78,37.34 49.78,37.59 U2.11
  Bottom 0.305: U$1.26 67.31,20.07 65.79,21.59 55.12,21.59 46.48,21.59 43.94,24.13 v43.94,24.89 v43.94,31.75
PC12  (via drill 0.3)
  Top 0.305: U1.83 44.07,64.52 v43.18,63.63 | v35.56,21.84 35.94,21.46 35.94,19.81 35.69,19.56 35.69,17.65 35.56,17.53 v35.56,12.57 | v41.66,6.48 44.45,3.68 U$1.17
  Bottom 0.305: v43.18,63.63 43.18,58.04 35.56,50.42 v35.56,21.84 | v41.66,6.48 v35.56,12.57
PD0  (via drill 0.25)
  Top 0.254: v47.37,69.98 U1.84 | v95.76,51.05 101.09,45.72 LCD.4
  Bottom 0.254: v47.37,69.98 47.75,70.36 76.83,70.36 95.76,51.44 v95.76,51.05
PD2  (via drill 0.25)
  Top 0.254: U1.82 45.72,70.87 74.17,70.87 80.52,64.52 v80.77,64.52 | v99.82,45.47 v95.38,49.91
  Bottom 0.254: v95.38,49.91 v80.77,64.52 | v99.82,45.47 100.84,44.45 102.62,44.45 LCD.1
PD4  (via drill 0.25)
  Top 0.254: U1.80 39.75,67.06 v40.64,67.94 | v81.79,62.48 81.92,62.61 86.23,62.61 v86.49,62.36 | v98.04,52.45 98.17,52.32 98.68,52.32 99.82,51.18 100.97,51.18 LCD.8
  Bottom 0.254: v40.64,67.94 43.05,70.36 45.97,70.36 47.24,69.09 69.98,69.09 74.17,64.9 79.38,64.9 v81.79,62.48 | v86.49,62.36 86.49,61.98 96.01,52.45 v98.04,52.45
PD5  (via drill 0.25)
  Top 0.254: U1.77 38.48,62.87 v54.74,62.87 | v92.46,51.82 98.55,51.82 v99.82,50.55
  Bottom 0.254: v54.74,62.87 75.56,62.87 76.96,61.47 83.19,61.47 92.46,52.2 v92.46,51.82 | v99.82,50.55 100.84,49.53 102.62,49.53 LCD.5
PD6  (via drill 0.25)
  Top 0.254: U1.78 38.35,68.58 v42.42,68.58 | v74.93,63.5 76.96,61.47 80.9,61.47 v81.53,60.83 | v94.36,48.9 95.38,48.9 v96.52,47.75
  Bottom 0.254: v42.42,68.58 69.85,68.58 v74.93,63.5 | v81.53,60.83 81.66,60.96 83.06,60.96 91.82,52.2 91.82,51.44 v94.36,48.9 | v96.52,47.75 98.55,47.75 99.44,48.64 100.97,48.64 LCD.6
PD7  (via drill 0.25)
  Top 0.254: U1.75 35.05,64.52 36.32,65.79 37.34,65.79 37.59,66.04 v37.97,66.04 | v99.82,48.01 v96.65,51.18
  Bottom 0.254: v37.97,66.04 37.97,66.42 38.1,66.55 38.1,67.56 41.4,70.87 76.96,70.87 v96.65,51.18 | v99.82,48.01 100.84,46.99 102.62,46.99 LCD.3
PD10  (via drill 0.25, 0.3)
  Top 0.305: U1.42 54.61,16.64 v53.34,17.91 | v51.18,17.53 50.8,17.14 50.8,15.62 51.44,14.99 52.7,14.99 53.34,14.35 v53.34,11.56 | v58.42,6.48 58.42,8.13 v59.56,9.27 | v58.42,17.91 57.66,18.67 57.66,21.08 60.71,24.13 v60.71,25.91 | v67.56,46.1 67.44,46.23 67.44,47.5 68.07,48.13 R23.1 | v58.29,4.57 57.53,4.57 56.39,5.71 55.75,6.35 53.59,6.35 53.21,6.35 v52.32,7.24
  Top 1.016: PB2.B1 72.14,48.13 70.48,48.13 69.98,48.64 68.33,48.64 R23.1
  Bottom 0.305: v53.34,17.91 52.96,17.53 v51.18,17.53 | v53.34,11.56 53.34,10.67 52.32,9.65 v52.32,7.24 | v59.56,9.27 59.56,11.94 58.42,13.08 v58.42,17.91 | v60.71,25.91 61.21,26.42 61.21,30.86 60.58,31.5 60.58,39.12 v67.56,46.1 | v58.42,6.48 58.42,4.57 v58.29,4.57
PD11  (via drill 0.25, 0.3)
  Top 0.305: U1.41 54.61,14.35 53.34,15.62 53.34,16.89 v51.18,19.05 | v47.62,19.68 47.62,20.07 51.56,24 51.94,24 v53.09,25.15 | v53.34,30.35 53.72,30.73 59.82,30.73 v60.07,30.99 | v70.23,60.45 70.48,60.83
  Top 1.016: PB1.B1 72.14,60.83 70.48,60.83 69.98,61.34 68.33,61.34 R22.1
  Bottom 0.305: v51.18,19.05 50.42,19.81 47.75,19.81 v47.62,19.68 | v53.09,25.15 53.59,25.65 53.59,30.1 v53.34,30.35 | v60.07,30.99 60.07,39.37 64.01,43.31 64.01,54.23 v70.23,60.45
PD12  (via drill 0.25)
  Top 0.305: U1.44 57.78,16.26 59.82,18.29 62.87,18.29 v62.99,18.16 | v65.53,20.7 66.8,21.97 67.94,21.97 R25.1
  Top 1.016: PB4.B1 72.14,21.46 70.48,21.46 69.98,21.97 68.33,21.97 R25.1
  Bottom 0.305: v65.53,20.7 v62.99,18.16
PD13  (via drill 0.25)
  Top 0.305: U1.43 57.78,13.72 59.05,14.99 60.33,14.99 60.96,15.62 v60.96,17.14 | v63.25,19.43 63.37,19.3 69.98,19.3 70.99,20.32 73.41,20.32 73.91,20.83 v73.91,23.62 | v73.91,29.34 73.91,33.78 72.52,35.18 PB3.B1
  Top 1.016: PB3.B1 72.14,35.43 70.48,35.43 69.98,35.94 68.33,35.94 R24.1
  Bottom 0.305: v63.25,19.43 v60.96,17.14 | v73.91,29.34 v73.91,23.62
PF4
  Top 0.305: U$1.8 21.59,8.13 19.05,10.67 U1.13
REF  (via drill 0.25)
  Top 0.254: v103.76,18.03 103.76,17.65 | 103.76,17.65 103.76,16.64 U4.6 | v100.58,17.65 103.76,17.65 | v93.98,17.53 93.6,17.14 93.6,16.64 U3.6
  Bottom 0.254: v103.76,18.03 103.76,27.18 102.36,28.57 REF_SEL.2 | v100.58,17.65 94.11,17.65 v93.98,17.53
REF_EXT  (via drill 0.25)
  Top 0.254: v106.93,26.92 REF_SEL.3
  Bottom 0.254: v106.93,26.92 107.7,26.16 107.7,10.41 U$1.39
VDD_B  (via drill 0.25)
  Top 0.305: U2.19 54.99,37.85 55.63,37.85 U2.20 55.63,37.97 55.63,38.23 55.75,38.35 58.42,38.35 R5.1 58.55,38.23 58.55,35.81 C3.1
  Top 0.61: LVL_EN.2 90.93,52.32 v86.61,52.32 | v65.53,40.64 59.82,40.64 58.55,39.37 58.55,38.48 R5.1
  Bottom 0.61: v86.61,52.32 76.83,42.55 67.44,42.55 v65.53,40.64

### Text on the board
tPlace: 1 | GND | EXT | 3V / 3V / 5V / 5V / PB2 / PA2 / PA3 / PF4 / PB13 / GND | PB14 / PB15 / PC6 / PC7 / PC8 / PC9 / PC12 / PB4 / PB5 / GND | PA15 / PB11 / PB1 / PB10 / PB12 / PC11_5 / PC10_5 / PB9_5 / PB8_5 / GND | PB0_5 / PA10_5 / PA9_5 / PA8_5 / AIN1_N / AIN1_P / AIN2_N / AIN2_P / REF_EXT / GND